# EAGLE design detector (EAGLE 9.0.0)
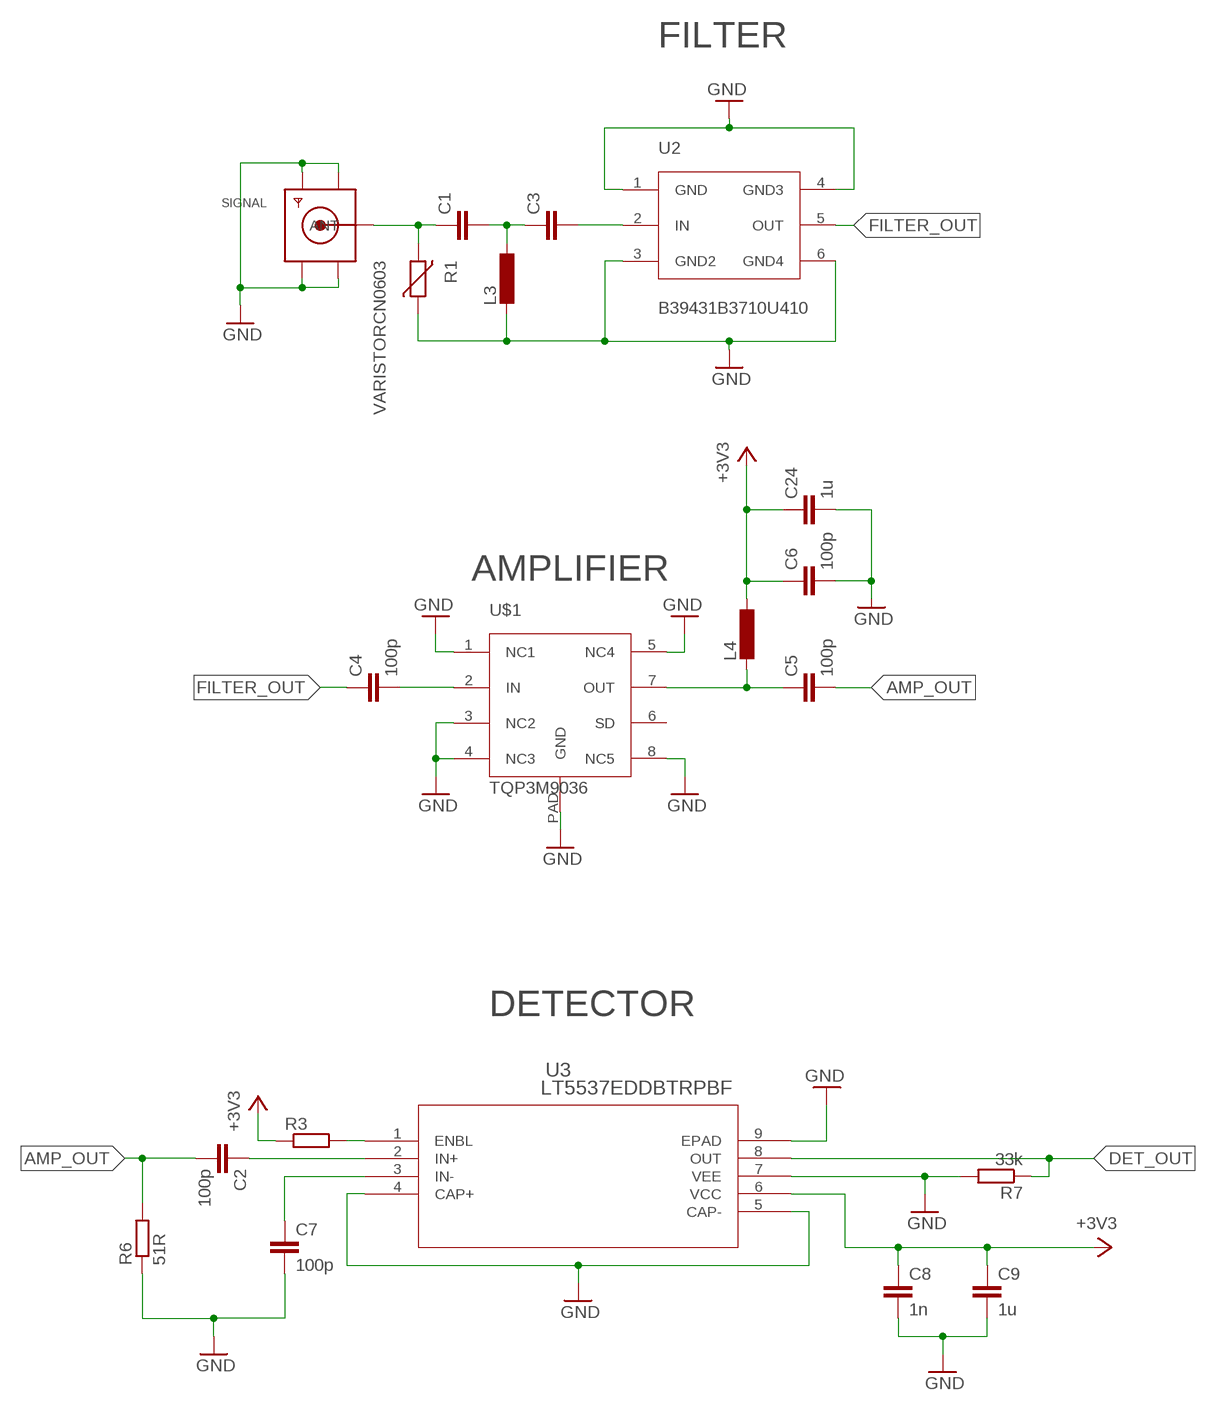
[diagram p0: schematic, sheet 1]

## Parts
C1  C-EUC0603  [C0603]
C2  100p  C-EUC0603  [C0603]
C3  C-EUC0603  [C0603]
C4  100p  C-EUC0603  [C0603]
C5  100p  C-EUC0603  [C0603]
C6  100p  C-EUC0603  [C0603]
C7  100p  C-EUC0603  [C0603]
C8  1n  C-EUC0603  [C0603]
C9  1u  C-EUC0603  [C0603]
C24  1u  C-EUC0603  [C0603]
L3  L-EUL2012C  [L2012C]
L4  L-EUL2012C  [L2012C]
R1  VARISTORCN0603  [CT/CN0603]
R3  R-EU_R0603  [R0603]
R6  51R  R-EU_R0603  [R0603]
R7  33k  R-EU_R0603  [R0603]
SIGNAL  SMACONNECTOR_EDGE  [SMA_EDGELAUNCH]
U2  B39431B3710U410  [SON120P300X300X110-6N]
U3  LT5537EDDBTRPBF  [DFN-8_DDB]
U$1  TQP3M9036  [DFN-8_2X2]

## Nets
+3V3: C6.1 C8.1 C9.1 C24.1 L4.1 R3.1 U3.6(VCC)
AMP_OUT: C2.2 C5.2 R6.2
DET_OUT: R7.1 U3.8(OUT)
FILTER_IN: C3.2 U2.2(IN)
FILTER_OUT: C4.1 U2.5(OUT)
GND: C6.2 C7.2 C8.2 C9.2 C24.2 L3.2 R1.1 R6.1 R7.2 SIGNAL.GND@1(GND4) SIGNAL.GND@2(GND3) SIGNAL.GND@3(GND2) SIGNAL.GND@4(GND1) U2.1(GND) U2.3(GND2) U2.4(GND3) U2.6(GND4) U3.4(CAP+) U3.5(CAP-) U3.7(VEE) U3.9(EPAD) U$1.1(NC1) U$1.3(NC2) U$1.4(NC3) U$1.5(NC4) U$1.8(NC5) U$1.PAD(GND)
N$1: R3.2 U3.1(ENBL)
N$2: C7.1 U3.3(IN-)
N$3: C2.1 U3.2(IN+)
N$5: C1.2 C3.1 L3.1
N$11: C4.2 U$1.2(IN)
N$27: C5.1 L4.2 U$1.7(OUT)
SIGNAL: C1.1 R1.2 SIGNAL.P(ANT)
Unconnected: U$1.6(SD)

## Notes on the sheet
- FILTER
- AMPLIFIER
- DETECTOR

## Library data of the parts
C1-C9 C24 = rcl:C-EU: CAPACITOR, European symbol; SPICEPREFIX: C
L3 L4 = rcl:L-EU: INDUCTOR, European symbol; SPICEPREFIX: L
R1 = varistor:VARISTOR: VARISTOR
R3 R6 R7 = rcl:R-EU_: RESISTOR, European symbol; SPICEPREFIX: R
SIGNAL = adafruit:SMACONNECTOR: SMA Connector 90° DIP SMA Connector, 50 Ohm (4UConnector: 07259)
U2 = SON120P300X300X110-6N:B39431B3710U410
U3 = LT5537EDDBTRPBF:LT5537EDDBTRPBF; AVAILABILITY: Unavailable; DESCRIPTION: LT5537 - Wide Dynamic Range RF/IF Log Detector; MF: Linear Technology; MP: LT5537EDDB#TRPBF; PACKAGE: DFN-8 Linear Technology; PRICE: 4.63 USD
U$1 = DFN-8:TQP3M9036

## Board
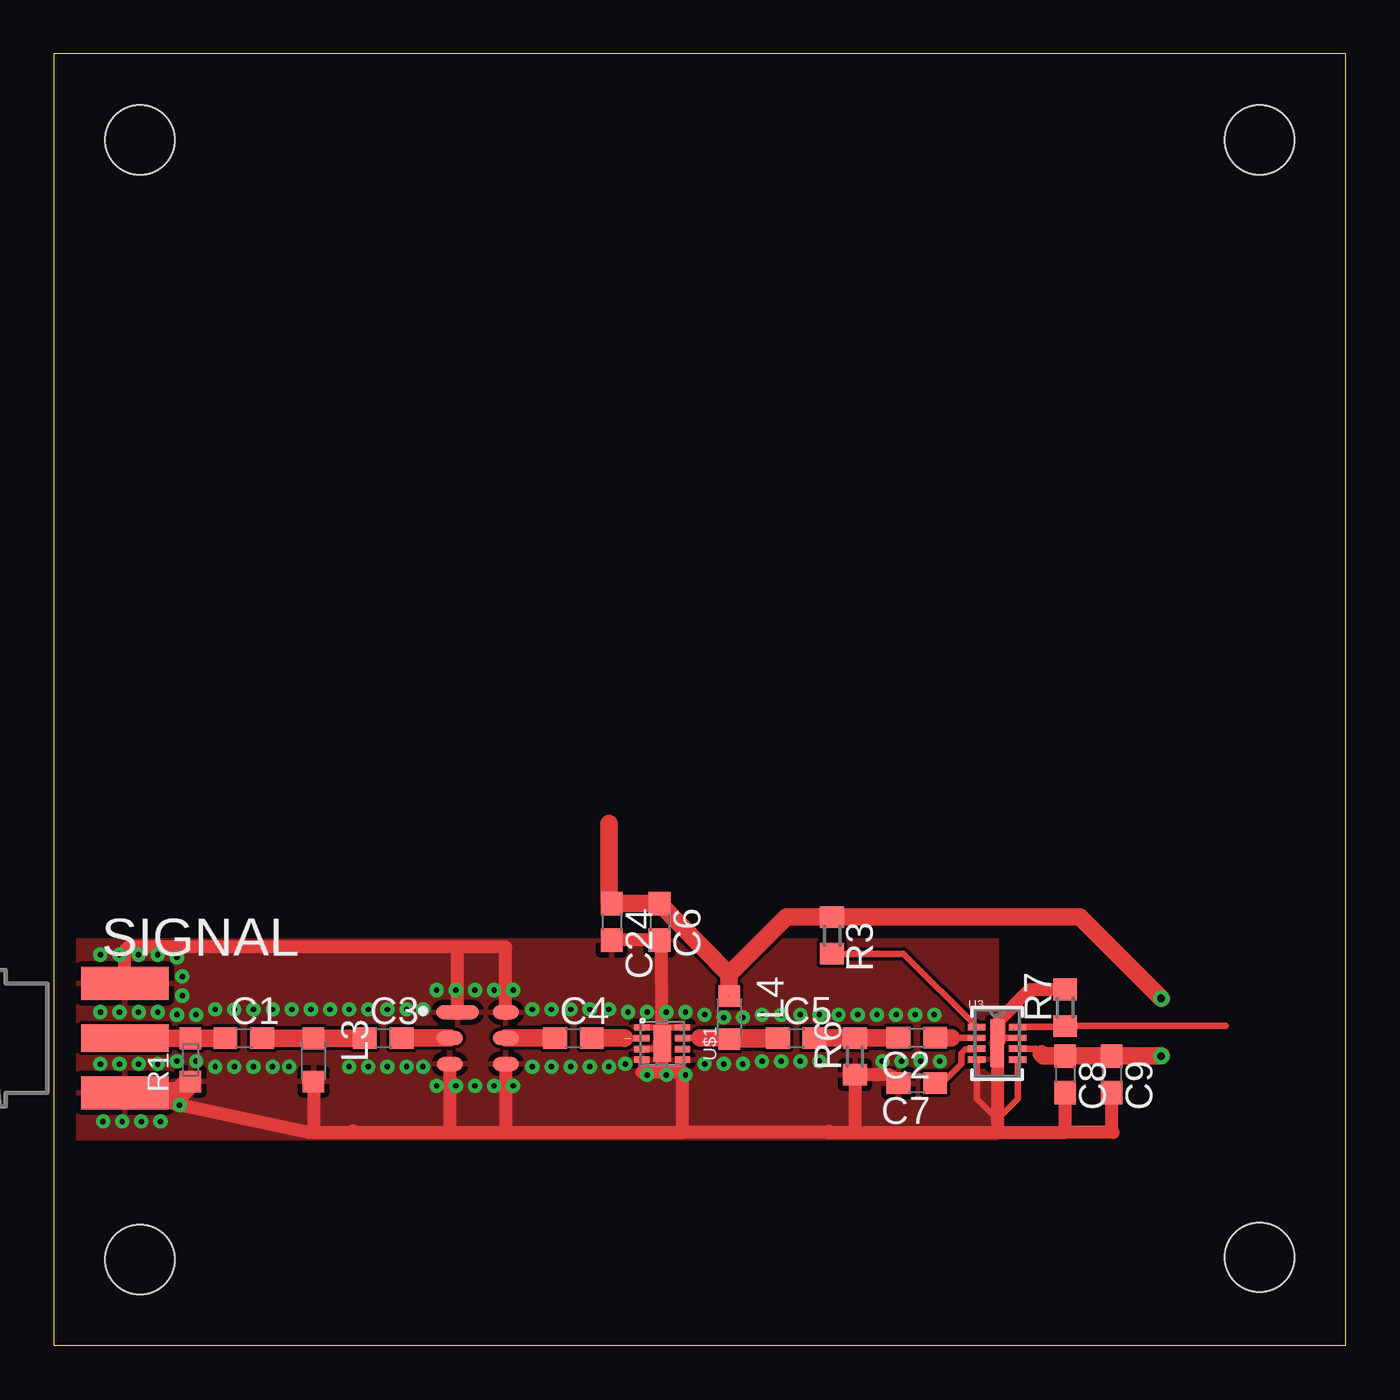
[diagram p1: board, top side]
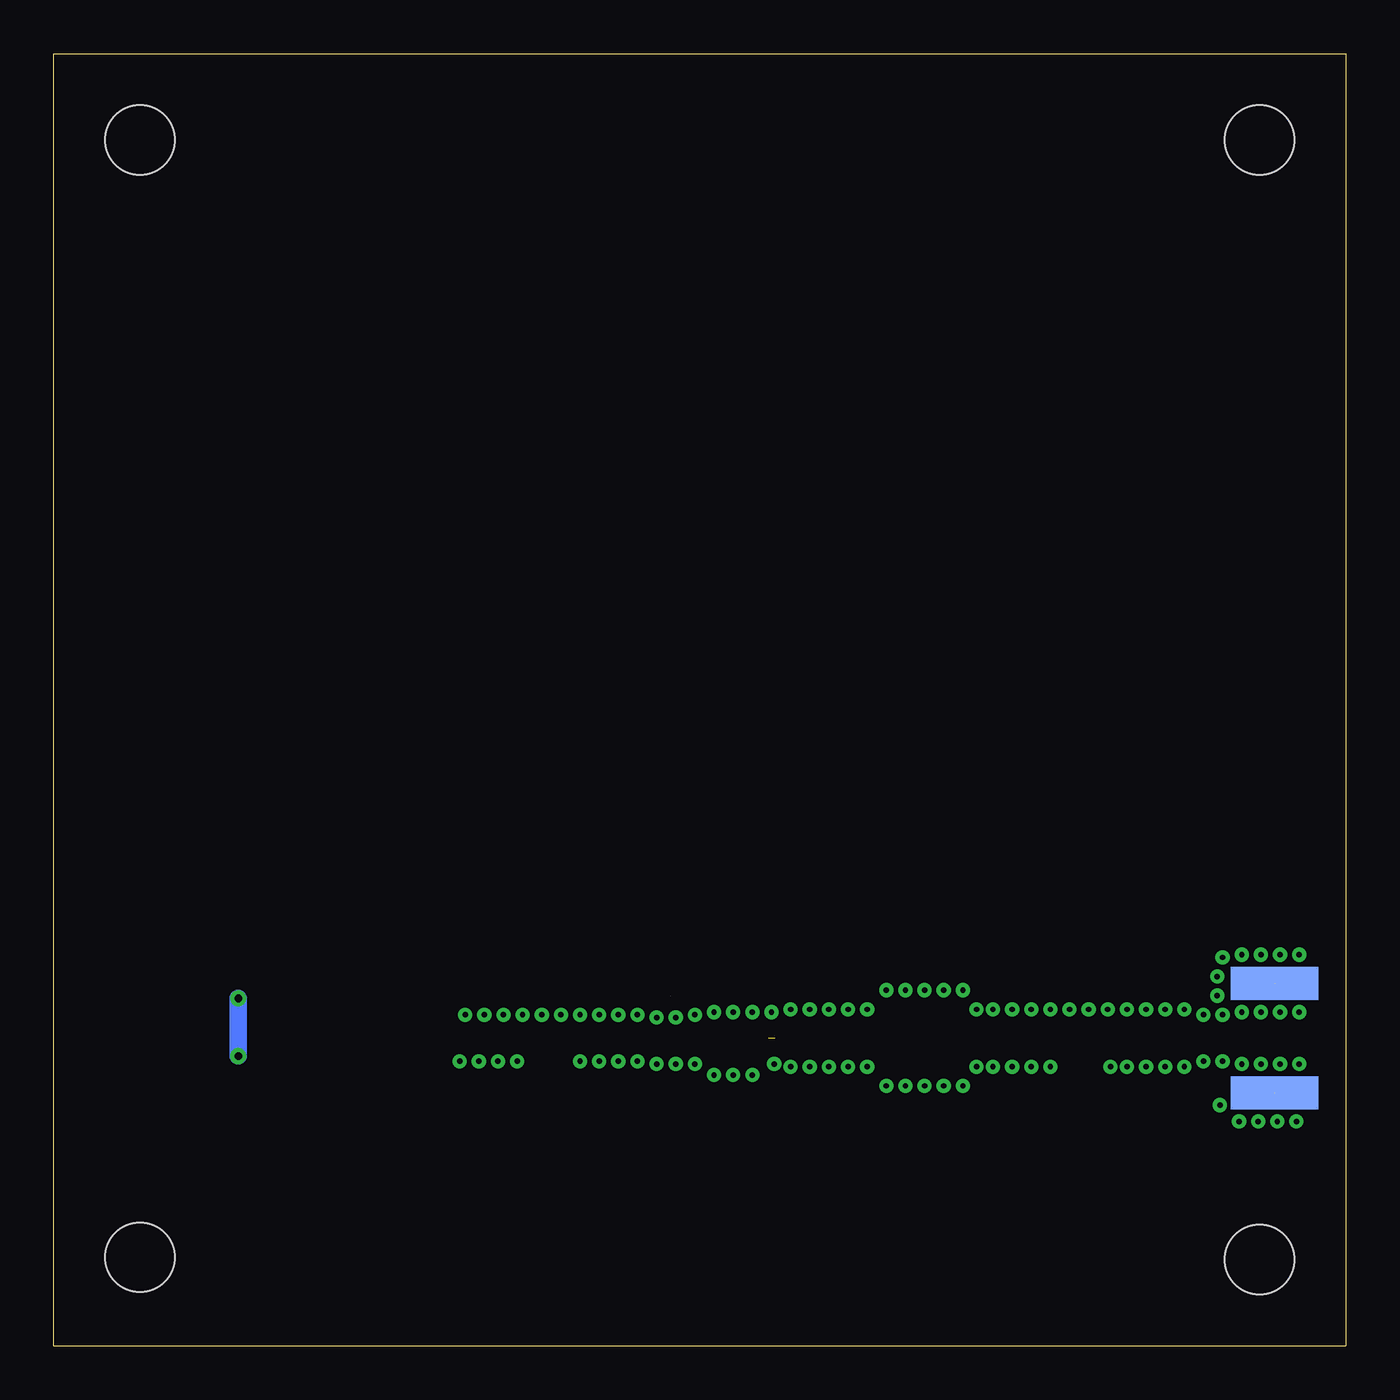
[diagram p2: board, bottom side, seen from below]

Size 60 x 60 mm. Coordinates in mm from the lower left corner, seen from the top.
Outline: 60,0 60,60 0,60 0,0 60,0
Copper layers (1*16): Top 0.035mm / dielectric 1.5mm / Bottom 0.035mm
Design rules "default": minimum track width 6mil, minimum drill 0.35mm, track to track 6mil, track to pad 6mil, pad to pad 6mil, via to via 6mil, smd to smd 6mil, copper to edge 40mil, drill to drill 6mil, minimum pad ring 10mil, minimum via ring 8mil, stop-mask expansion 4mil, vias tented up to drill 0mil, thermal gap 10mil
Holes 3.2 mm at 4,56 56,56 4,4 56,4.1
tRestrict: area 2.4,2.4 to 5.6,5.6; area 54.4,2.4 to 57.6,5.6; area 54.4,54.4 to 57.6,57.6; area 2.4,54.4 to 5.6,57.6
bRestrict: area 2.4,54.4 to 5.6,57.6; area 54.4,54.4 to 57.6,57.6; area 2.4,2.4 to 5.6,5.6; area 54.4,2.4 to 57.6,5.6

### Footprints (pad centres in the part's own frame; a part is rotated, then mirrored left to right if it is on the bottom)
C0603 = smd 1.1 x 1: 1 -0.85,0; 2 0.85,0
L2012C = smd 1 x 1: 1 -1,0; 2 1,0
CT/CN0603 = smd 1 x 1: 1 -1,0; 2 1,0
R0603 = smd 1 x 1.1: 1 -0.85,0; 2 0.85,0
SMA_EDGELAUNCH = smd 4.064 x 1.524: GND@1 2.032,-2.54; GND@2 2.032,2.54 | smd 4.064 x 1.524 bottom: GND@3 2.032,2.54; GND@4 2.032,-2.54 | smd 4.064 x 1.27: P 2.032,0
SON120P300X300X110-6N = smd 1.96 x 0.65: 1 -0.93,1.2 | smd 1.2 x 0.65: 2 -1.3,0; 3 -1.3,-1.2; 4 1.3,-1.2; 5 1.3,0; 6 1.3,1.2
DFN-8_DDB = smd 0.805 x 0.3: 1 -0.952,0.75; 2 -0.952,0.25; 3 -0.952,-0.25; 4 -0.952,-0.75; 5 0.952,-0.75; 6 0.952,-0.25; 7 0.952,0.25; 8 0.952,0.75 | smd 0.61 x 2.2: 9 0,0
DFN-8_2X2 = smd 0.3 x 0.7: 1 -0.75,-0.95; 2 -0.25,-0.95; 3 0.25,-0.95; 4 0.75,-0.95; 5 0.75,0.95; 6 0.25,0.95; 7 -0.25,0.95; 8 -0.75,0.95 | smd 1.7 x 0.8: PAD 0,0

### Placement (x,y rotation side)
C1  8.83,14.29 0 top
C2  40.08,14.3 180 top
C3  15.3,14.29 0 top
C4  24.13,14.29 0 top
C5  34.48,14.29 0 top
C6  28.13,19.69 270 top
C7  40.08,12.19 180 top
C8  46.96,12.6 270 top
C9  49.12,12.6 270 top
C24  25.91,19.69 270 top
L3  12.06,13.27 270 top
L4  31.37,15.24 270 top
R1  6.35,13.27 90 top
R3  36.14,19.05 270 top
R6  37.21,13.44 90 top
R7  46.96,15.7 90 top
SIGNAL  1.27,14.29 0 top
U2  19.69,14.29 0 top
U3  43.81,14.05 0 top
U$1  28.26,14.03 270 top

### Tracks (layer width: path | path; a pad name or v marks a point on that pad's centre or on a via)
+3V3  (via drill 0.35)  (1 unrouted)
  Top 0.305: U3.6 45.61,13.8 45.86,13.55
  Top 0.813: 36.13,19.91 R3.1 | 45.86,13.55 45.96,13.45 C8.1 C9.1 v51.44,13.45 | 36.13,19.91 34.04,19.91 31.37,17.25 | 31.37,17.25 30.06,18.56 C6.1 C24.1 25.78,20.66 25.78,24.26 | 31.37,16.25 31.37,17.25 | v51.44,16.13 47.65,19.91 36.13,19.91
  Bottom 0.813: v51.44,13.45 v51.44,16.13
AMP_OUT
  Top 0.813: C5.2 R6.2 39.22,14.29 C2.2
DET_OUT
  Top 0.305: U3.8 46.91,14.8 R7.1 54.43,14.85
FILTER_IN
  Top 0.813: U2.2 C3.2
FILTER_OUT
  Top 0.813: C4.1 U2.5
GND  (via drill 0.25)  (2 unrouted)
  Top 0.305: 29.21,12.7 U$1.5 | 27.3,12.7 U$1.4 | U$1.1 28.12,14.78 28.26,14.92 28.4,14.78 U$1.8 | U$1.3 28.13,13.78 28.26,13.65 | U3.4 42.86,11.47 43.81,10.52 44.77,11.47 U3.5 | U3.7 44.06,14.3 U3.9
  Top 0.61: SIGNAL.GND@2 3.3,18.35 3.49,18.54 18.73,18.54 | 18.73,18.54 20.95,18.54 20.98,18.51 U2.6 | C24.2 C6.2 28.23,18.73 28.26,14.92 U$1.PAD 28.26,13.65 28.26,12.7 | U2.1 18.75,18.52 18.73,18.54 | SIGNAL.GND@1 11.88,9.91 12.06,9.91 | 12.06,9.91 13.97,9.91 | 13.97,9.91 18.41,9.91 | 18.41,9.91 20.95,9.91 | 20.95,9.91 29.21,9.91 | 29.21,9.91 29.21,12.7 28.26,12.7 | 28.26,12.7 27.3,12.7 | U2.3 18.38,9.94 18.41,9.91 | U2.4 20.98,9.94 20.95,9.91 | 13.88,9.99 13.97,9.91 | 36,9.97 35.94,9.91 | 35.94,9.91 29.21,9.91 | 35.94,9.91 37.34,9.91 | 37.34,9.91 43.81,9.91 | 43.81,9.91 46.96,9.91 | L3.2 12.06,9.91 | R6.1 37.21,12.57 | 37.21,12.57 37.21,10.03 37.34,9.91 | C7.2 38.85,12.57 37.21,12.57 | 43.81,9.91 43.81,10.52 U3.9 43.91,14.14 43.91,15.14 45.32,16.55 R7.2 | C8.2 46.96,9.91 | C9.2 49.12,9.98 49.2,9.91 46.96,9.91
  Top 1.016: SIGNAL.GND@1 5.83,11.75 R1.1
  other vias: 5.71,15.37 6.6,15.37 7.49,15.62 8.38,15.62 9.27,15.62 10.16,15.62 11.05,15.62 11.94,15.62 12.83,15.62 13.72,15.62 14.6,15.62 15.49,15.62 16.38,15.62 5.71,13.21 7.49,12.95 8.38,12.95 9.27,12.95 10.16,12.95 13.72,12.95 14.6,12.95 15.49,12.95 16.38,12.95 17.14,12.95 17.14,15.62 6.6,13.21 4.83,15.49 3.94,15.49 3.05,15.49 2.16,15.49 2.16,13.08 3.05,13.08 3.94,13.08 4.83,13.08 17.78,16.51 18.67,16.51 19.56,16.51 20.45,16.51 21.34,16.51 22.22,15.62 22.22,12.95 17.78,12.07 18.67,12.07 19.56,12.07 20.45,12.07 21.34,12.07 23.11,15.62 24,15.62 24.89,15.62 25.78,15.62 23.11,12.95 24,12.95 24.89,12.95 25.78,12.95 26.67,15.49 27.56,15.49 28.45,15.49 29.34,15.49 26.54,13.08 27.56,12.57 28.45,12.57 29.34,12.57 30.23,13.08 30.23,15.37 31.11,13.08 32,13.08 32.89,13.21 31.11,15.24 32,15.24 32.89,15.37 33.78,15.37 33.78,13.21 34.67,13.21 34.67,15.37 35.56,13.21 35.56,15.37 36.45,15.37 37.34,15.37 38.23,15.37 39.12,15.37 40,15.37 40.89,15.37 38.48,13.21 39.37,13.21 40.26,13.21 41.15,13.21 5.97,16.26 5.97,17.15 5.71,18.03 4.83,18.16 3.94,18.16 3.05,18.16 2.16,18.16 5.84,11.18 4.95,10.41 4.06,10.41 3.17,10.41 2.29,10.41 10.92,12.95
  pour Top (isolate 0.152): -0.79,18.85 -0.79,9.6 43.81,9.6 43.81,18.85
N$1
  Top 0.305: R3.2 39.46,18.2 U3.1
N$2
  Top 0.305: C7.1 41.26,12.19 42.16,13.09 42.16,13.57 42.33,13.75 42.82,13.75 U3.3
N$3
  Top 0.305: 41.68,14.3 U3.2
  Top 0.813: C2.1 41.68,14.3
N$5
  Top 0.813: C3.1 14.43,14.26 L3.1 9.7,14.26 C1.2
N$11  (1 unrouted)
  Top 0.305: 26.8,14.28 U$1.2
  Top 0.813: C4.2 26.51,14.29 26.52,14.28
N$27
  Top 0.305: U$1.7 30,14.29
  Top 0.813: 32.28,14.28 30,14.29 C5.1 33.46,14.25 L4.2
SIGNAL
  Top 0.813: C1.1 7.96,14.27 R1.2 3.32,14.27 SIGNAL.P